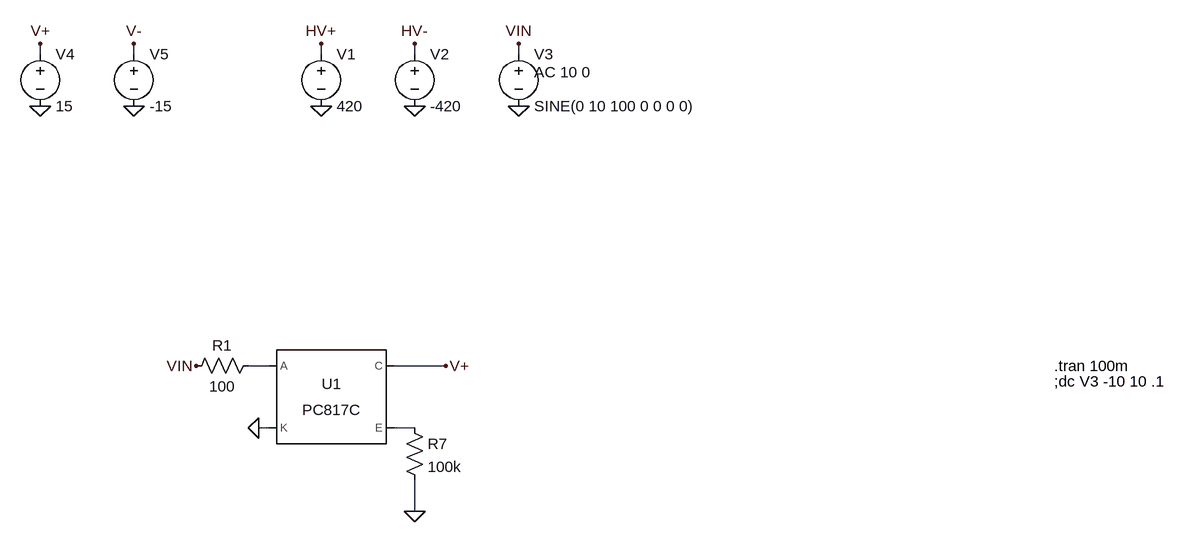
[diagram p0: schematic opto2.asc]
opto2.asc, the LTspice schematic file:
Version 4
SHEET 1 1216 932
WIRE -544 -208 -544 -224
WIRE -400 -208 -400 -224
WIRE -112 -208 -112 -224
WIRE 32 -208 32 -224
WIRE 192 -208 192 -224
WIRE -192 272 -224 272
WIRE 80 272 0 272
WIRE -192 368 -208 368
WIRE 32 368 0 368
WIRE 32 496 32 448
FLAG -112 -128 0
FLAG 32 -128 0
FLAG 192 -128 0
FLAG -112 -224 HV+
FLAG 32 -224 HV-
FLAG 192 -224 VIN
FLAG -544 -128 0
FLAG -400 -128 0
FLAG -544 -224 V+
FLAG -400 -224 V-
FLAG 32 496 0
FLAG 80 272 V+
FLAG -304 272 VIN
FLAG -208 368 0
SYMBOL voltage -112 -224 R0
WINDOW 123 0 0 Left 2
WINDOW 39 0 0 Left 2
SYMATTR InstName V1
SYMATTR Value 420
SYMBOL voltage 32 -224 R0
WINDOW 123 0 0 Left 2
WINDOW 39 0 0 Left 2
SYMATTR InstName V2
SYMATTR Value -420
SYMBOL voltage 192 -224 R0
WINDOW 123 24 44 Left 2
WINDOW 39 0 0 Left 2
SYMATTR Value2 AC 10 0
SYMATTR InstName V3
SYMATTR Value SINE(0 10 100 0 0 0 0)
SYMBOL voltage -544 -224 R0
WINDOW 123 0 0 Left 2
WINDOW 39 0 0 Left 2
SYMATTR InstName V4
SYMATTR Value 15
SYMBOL voltage -400 -224 R0
WINDOW 123 0 0 Left 2
WINDOW 39 0 0 Left 2
SYMATTR InstName V5
SYMATTR Value -15
SYMBOL res 16 352 R0
SYMATTR InstName R7
SYMATTR Value 100k
SYMBOL Optos\\PC817C -96 320 R0
SYMATTR InstName U1
SYMBOL res -320 288 R270
WINDOW 0 32 56 VTop 2
WINDOW 3 0 56 VBottom 2
SYMATTR InstName R1
SYMATTR Value 100
TEXT 1016 296 Left 2 !;dc V3 -10 10 .1
TEXT 1016 272 Left 2 !.tran 100m

The netlist it stands for:
* opto2.asc
V1 HV+ 0 420
V2 HV- 0 -420
V3 VIN 0 SINE(0 10 100 0 0 0 0) AC 10 0
V4 V+ 0 15
V5 V- 0 -15
R7 N002 0 100k
XU1 N001 0 V+ N002 PC817 Igain=2.3m  ; PC817C, pins A K C E
R1 VIN N001 100
;dc V3 -10 10 .1
.tran 100m
.lib PC817.sub
.backanno
.end